# EAGLE design HumidiTemp-v00 (EAGLE 5.10)
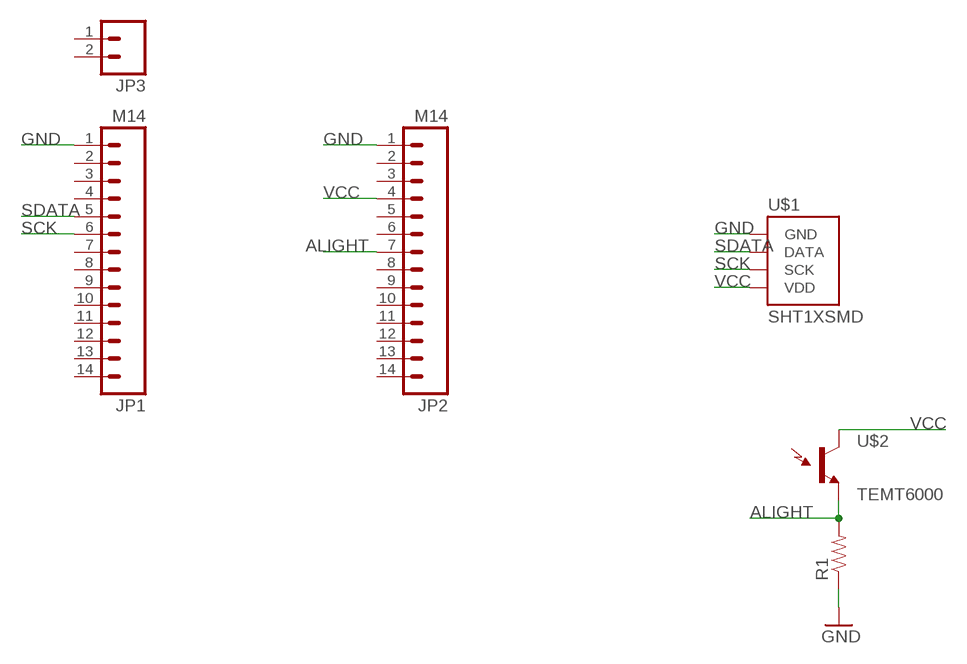
[diagram p0: schematic, sheet 1]

## Parts
JP1  M14  [1X14]
JP2  M14  [1X14]
JP3  M02PTH  [1X02]
R1  RESISTORPTH1  [AXIAL-0.3]
U$1  SHT1XSMD  [SHT1X]
U$2  TEMT6000  [TEMT6000-SEN]

## Nets
ALIGHT: JP2.7 R1.P$2 U$2.EMITTER(E1)
GND: JP1.1 JP2.1 R1.P$1 U$1.1(GND)
SCK: JP1.6 U$1.3(SCK)
SDATA: JP1.5 U$1.2(DATA)
VCC: JP2.4 U$1.4(VDD) U$2.COLLECTOR(C1)
Unconnected: JP1.2 JP1.3 JP1.4 JP1.7 JP1.8 JP1.9 JP1.10 JP1.11 JP1.12 JP1.13 JP1.14 JP2.2 JP2.3 JP2.5 JP2.6 JP2.8 JP2.9 JP2.10 JP2.11 JP2.12 JP2.13 JP2.14 JP3.1 JP3.2

## Library data of the parts
JP1 JP2 = SparkFun:M14: Header 14 Standard 14-pin 0.1" header. Use with straight break away headers (SKU : PRT-00116), right angle break away headers (PRT-00553), swiss pins (PRT-00743), machine pins (PRT-00117), and female headers (PRT-00115).
JP3 = SparkFun:M02: Header 2 Standard 2-pin 0.1" header. Use with straight break away headers (SKU : PRT-00116), right angle break away headers (PRT-00553), swiss pins (PRT-00743), machine pins (PRT-00117), and female headers (PRT-00115). Molex polarized connector foot print use with SKU : PRT-08233 with associated crimp pins and housings.
R1 = SparkFun:RESISTOR: Resistor Basic schematic elements and footprints for 0603, 1206, and PTH 1/10th watt (small) resistors.
U$1 = SparkFun:SHT1X: SHT1x Humdity Sensor Sensirion humdity sensor. Schematic element and footprint proven. Spark Fun Electronics SKU : COM-08227
U$2 = SparkFun:TEMT6000: Ambient Light Sensor Simple light detection sensor. Output varies with light intensity input. Spark Fun Electronics SKU : COM-08348

## Board
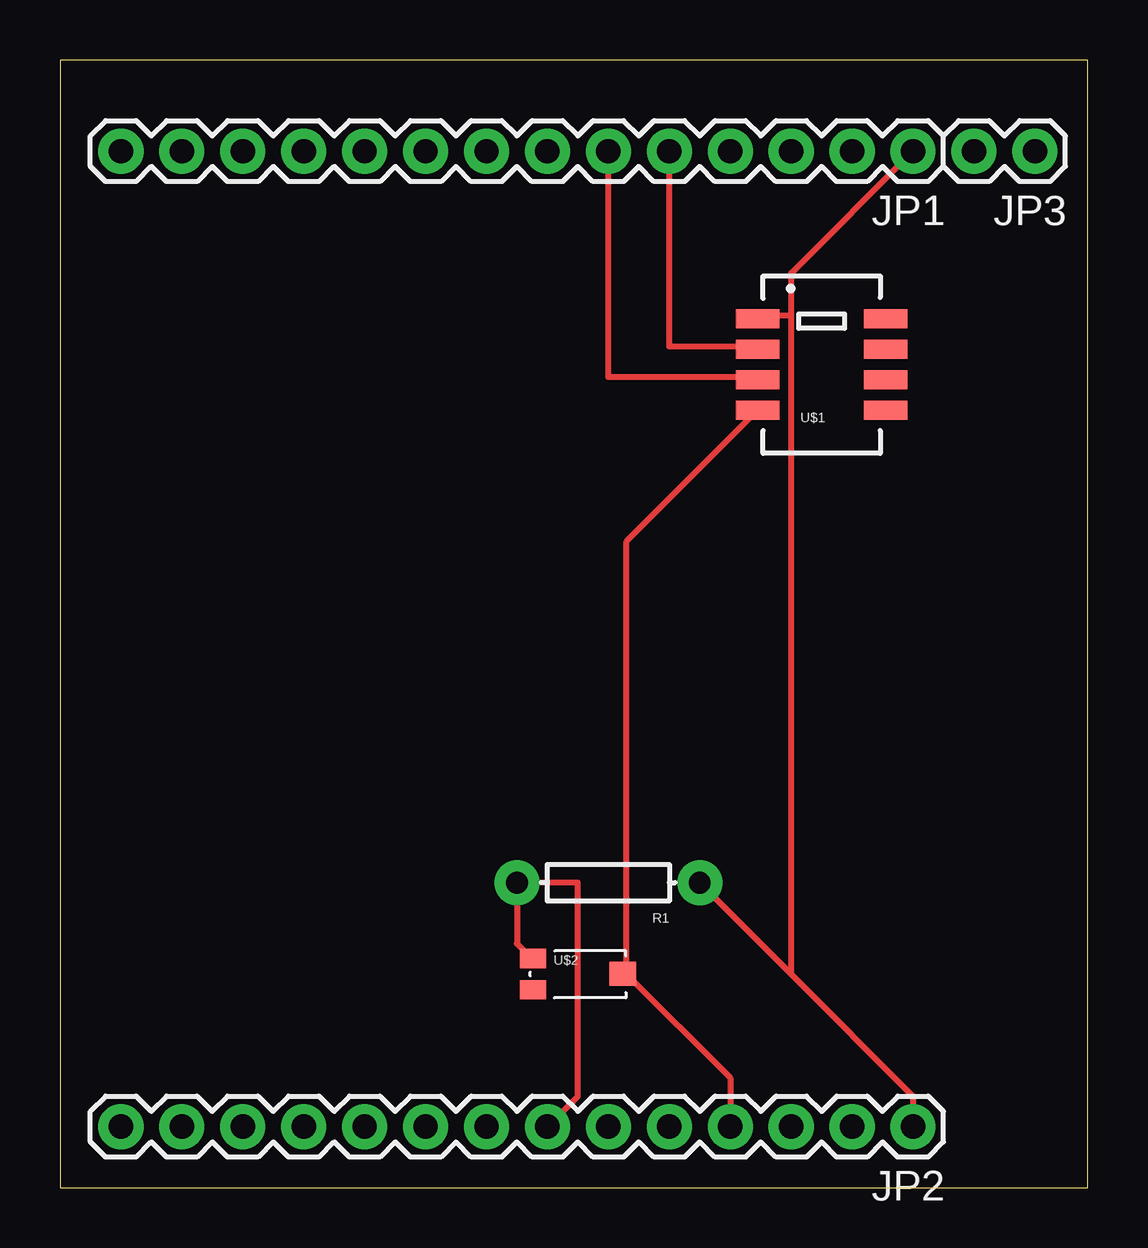
[diagram p1: board, top side]

Size 42.85 x 46.98 mm. Coordinates in mm from the lower left corner, seen from the top.
Outline: 0,0 42.85,0 42.85,46.98 0,46.98 0,0
Copper layers (1*16): Top 0.035mm / dielectric 1.5mm / Bottom 0.035mm
Design rules "default": minimum track width 10mil, minimum drill 24mil, track to track 8mil, track to pad 8mil, pad to pad 8mil, via to via 8mil, smd to smd 8mil, copper to edge 40mil, drill to drill 8mil, minimum pad ring 10mil, minimum via ring 8mil, stop-mask expansion 4mil, vias tented up to drill 0mil, thermal gap 10mil

### Footprints (pad centres in the part's own frame; a part is rotated, then mirrored left to right if it is on the bottom)
1X14 = drill 1.016 pad 1.88 round: 1 0,0; 2 2.54,0; 3 5.08,0; 4 7.62,0; 5 10.16,0; 6 12.7,0; 7 15.24,0; 8 17.78,0; 9 20.32,0; 10 22.86,0; 11 25.4,0; 12 27.94,0; 13 30.48,0; 14 33.02,0
1X02 = drill 1.016 pad 1.88 round: 1 0,0; 2 2.54,0
AXIAL-0.3 = drill 0.9 pad 1.88 round: P$1 -3.81,0; P$2 3.81,0
SHT1X = smd 1.8 x 0.8: 1 -2.667,1.905; 2 -2.667,0.635; 3 -2.667,-0.635; 4 -2.667,-1.905; 5 2.667,-1.905; 6 2.667,-0.635; 7 2.667,0.635; 8 2.667,1.905
TEMT6000-SEN = smd 1.1 x 0.8: BASE -1.87,-0.65; EMITTER -1.87,0.65 | smd 1.1 x 1: COLLECTOR 1.86,0.01

### Placement (x,y rotation side)
JP1  35.56,43.18 180 top
JP2  35.56,2.54 180 top
JP3  40.64,43.18 180 top
R1  22.86,12.7 180 top
U$1  31.75,34.29 0 top
U$2  21.59,8.89 0 top

### Tracks (layer width: path | path; a pad name or v marks a point on that pad's centre or on a via)
ALIGHT
  Top 0.254: U$2.EMITTER 19.56,9.65 19.05,10.16 R1.P$2 21.59,12.7 21.59,3.81 JP2.7
GND
  Top 0.254: 30.48,8.89 35.56,3.81 JP2.1 | R1.P$1 30.48,8.89 | JP1.1 30.48,38.1 30.48,36.32 | 30.48,8.89 30.48,36.32 | 30.48,36.32 29.21,36.32 U$1.1
SCK
  Top 0.254: JP1.6 22.86,33.78 28.96,33.78 U$1.3
SDATA
  Top 0.254: JP1.5 25.4,35.05 28.96,35.05 U$1.2
VCC
  Top 0.254: JP2.4 27.94,4.57 23.62,8.89 U$2.COLLECTOR 23.62,9.14 23.62,26.92 U$1.4